# Altium schematic sheet Sheet1.SchDoc
size A4
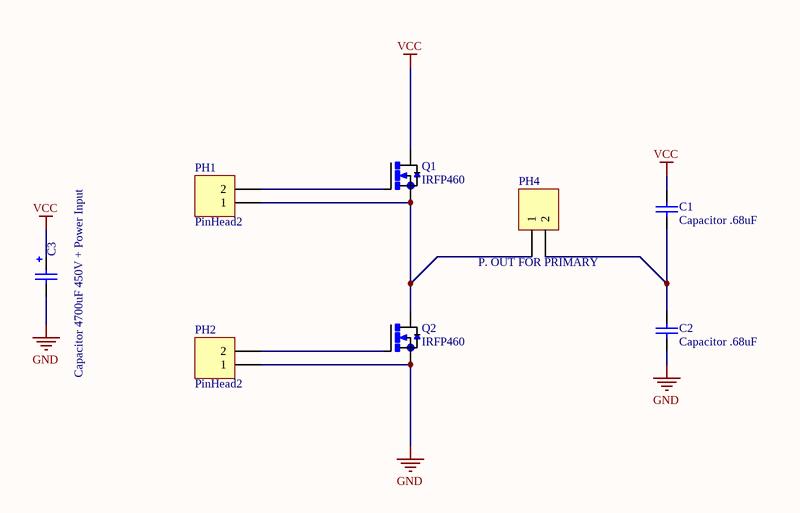
[diagram p0: Sheet1.SchDoc]

## Parts
C1  Capacitor .68uF  [Capacitor .68uF]
C2  Capacitor .68uF  [Capacitor .68uF]
C3  Capacitor 4700uF 450V + Power Input  [Capacitor 4700uF 450V RIFA]
PH1  PinHead2  [PinHead2]
PH2  PinHead2  [PinHead2]
PH4  P. OUT FOR PRIMARY  [P. OUT FOR PRIMARY]
Q1  IRFP460  [IRFP460]
Q2  IRFP460  [IRFP460]

## Nets
GND: C2.2 C3.1 PH2.1 Q2.S
VCC: C1.1 C3.2 Q1.D
NetC1_2: C1.2 C2.1 PH4.2
NetPH1_1: PH1.1 PH4.1 Q1.S Q2.D
NetPH1_2: PH1.2 Q1.G
NetPH2_2: PH2.2 Q2.G

## Library data of the parts
C3 = Capacitor 4700uF 450V